# Altium schematic sheet TITLE.SchDoc: F2837x controlCARD
size 431 x 279 mm; Organization: Texas Instruments; Revision: 1.3
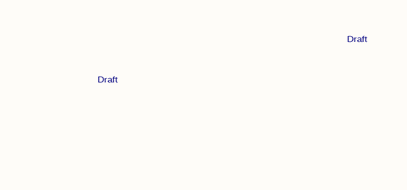
[diagram p0: TITLE.SchDoc, top right]
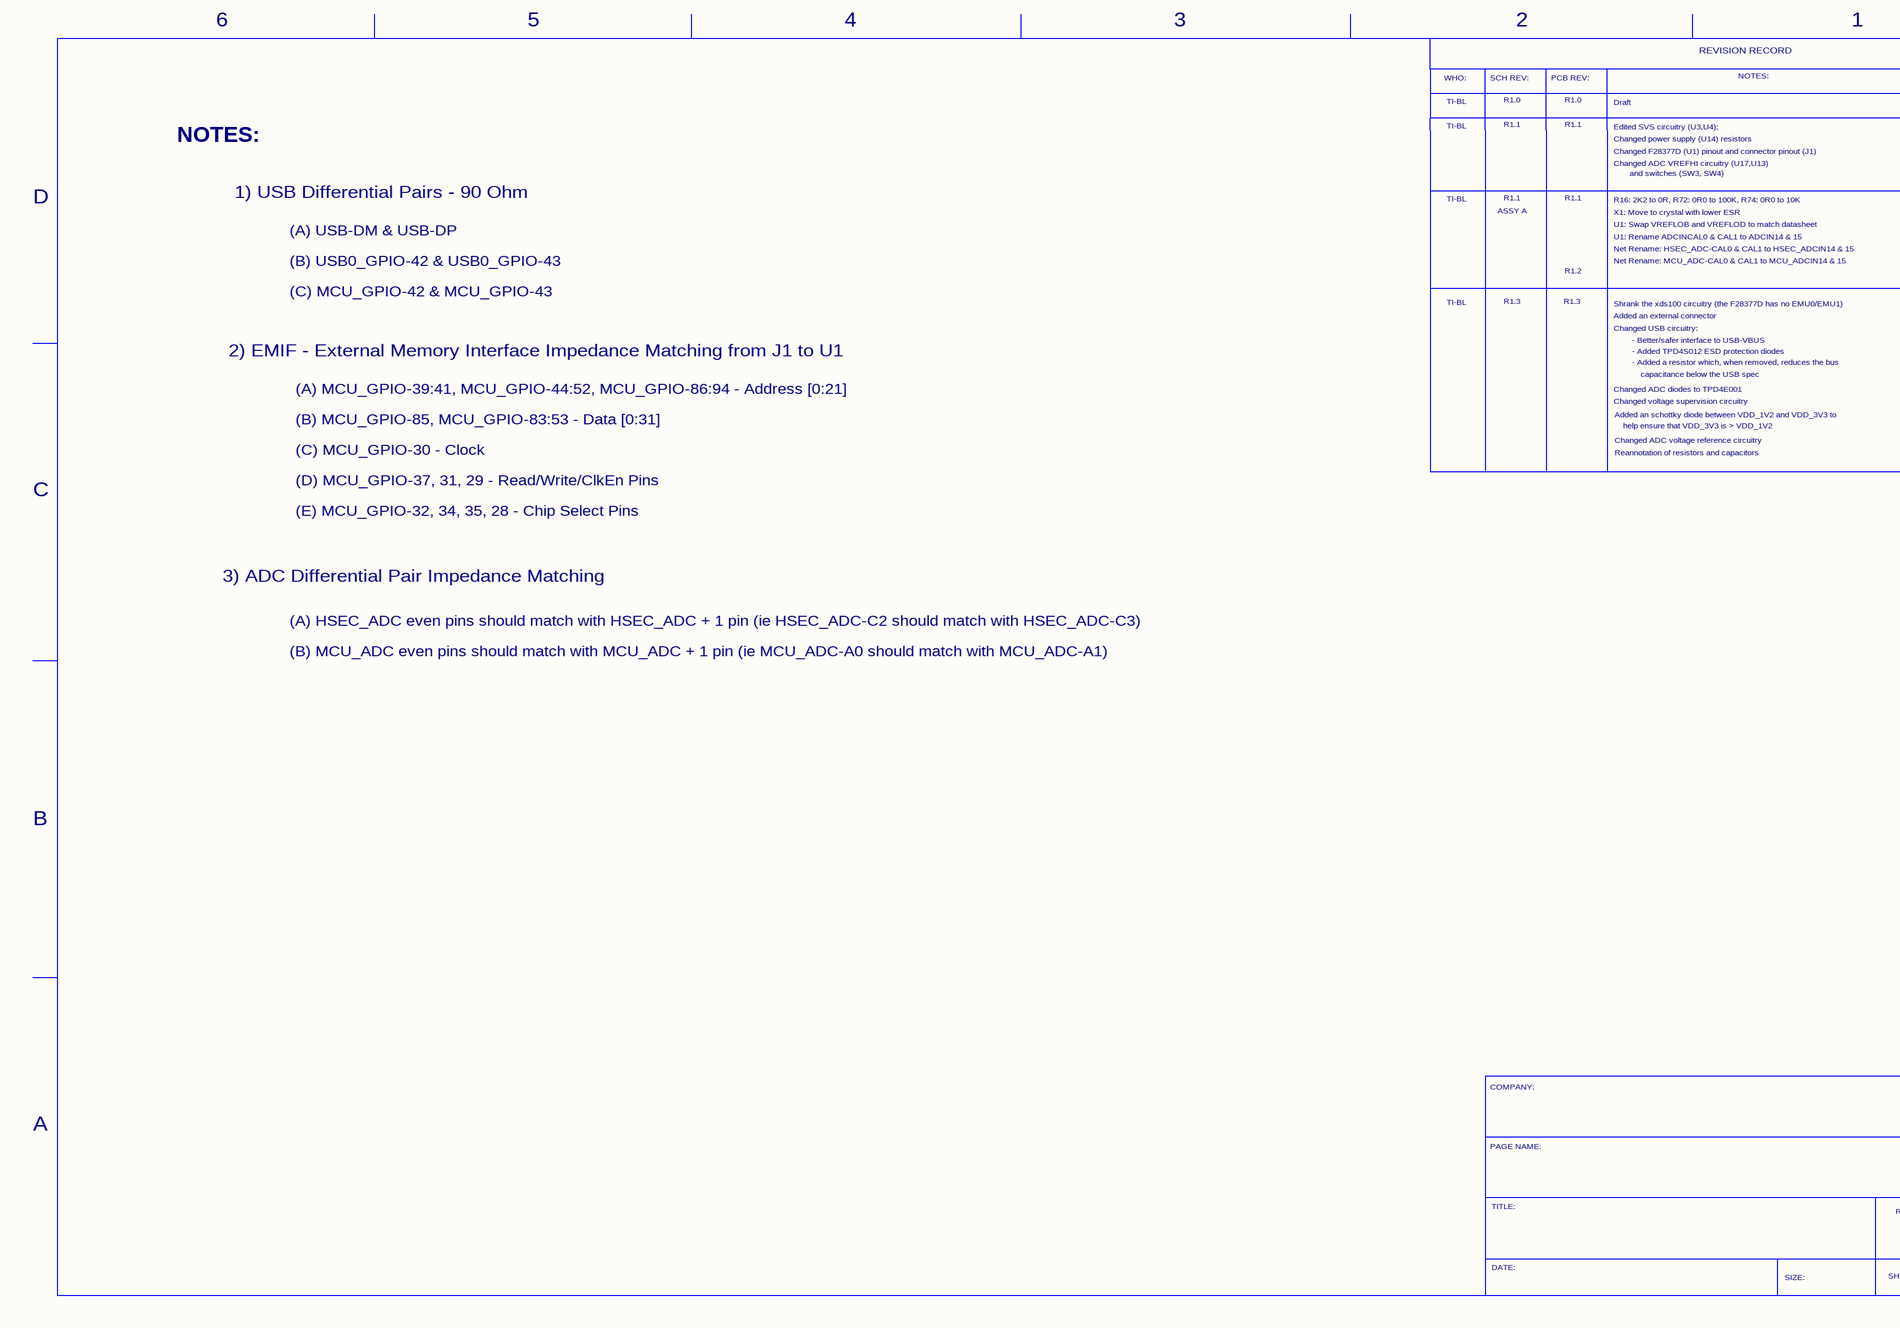
[diagram p1: TITLE.SchDoc, bottom left]
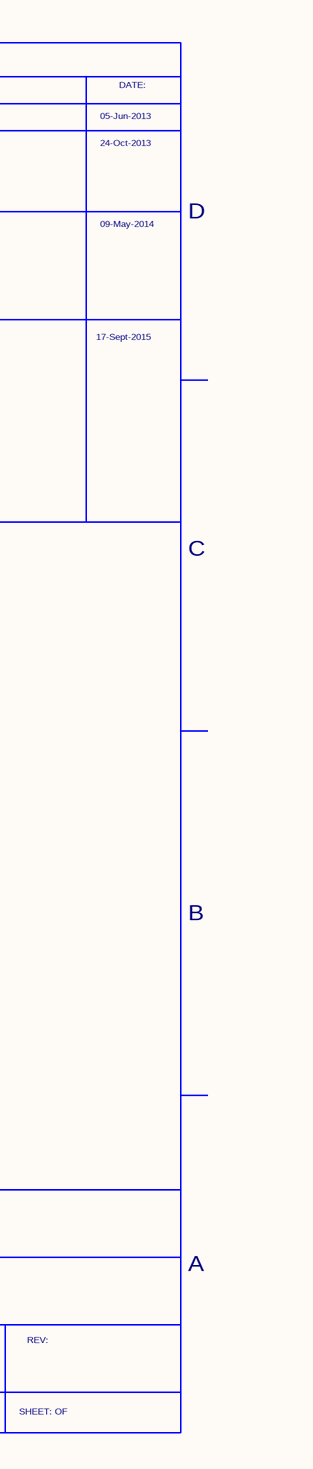
[diagram p2: TITLE.SchDoc, bottom right]

## Notes on the sheet
- Draft
- 6
- 5
- 4
- 3
- 2
- REVISION RECORD
- 1
- WHO:
- TI-BL
- SCH REV:
- R1.1
- R1.0
- PCB REV:
- Edited SVS circuitry (U3,U4);
- NOTES:
- 24-Oct-2013
- 05-Jun-2013
- DATE:
- Changed power supply (U14) resistors
- Changed F28377D (U1) pinout and connector pinout (J1)
- Changed ADC VREFHI circuitry (U17,U13)
- and switches (SW3, SW4)
- D
- 1) USB Differential Pairs - 90 Ohm
- (A) USB-DM & USB-DP
- ASSY A
- R16: 2K2 to 0R, R72: 0R0 to 100K, R74: 0R0 to 10K
- Net Rename: HSEC_ADC-CAL0 & CAL1 to HSEC_ADCIN14 & 15
- U1: Swap VREFLOB and VREFLOD to match datasheet
- U1: Rename ADCINCAL0 & CAL1 to ADCIN14 & 15
- X1: Move to crystal with lower ESR
- 09-May-2014
- (B) USB0_GPIO-42 & USB0_GPIO-43
- (C) MCU_GPIO-42 & MCU_GPIO-43
- R1.3
- R1.2
- Net Rename: MCU_ADC-CAL0 & CAL1 to MCU_ADCIN14 & 15
- Shrank the xds100 circuitry (the F28377D has no EMU0/EMU1)
- Added an external connector
- 17-Sept-2015
- 2) EMIF - External Memory Interface Impedance Matching from J1 to U1
- Changed USB circuitry:
- - Better/safer interface to USB-VBUS
- - Added TPD4S012 ESD protection diodes
- - Added a resistor which, when removed, reduces the bus
- capacitance below the USB spec
- (A) MCU_GPIO-39:41, MCU_GPIO-44:52, MCU_GPIO-86:94 - Address [0:21]
- (B) MCU_GPIO-85, MCU_GPIO-83:53 - Data [0:31]
- Changed voltage supervision circuitry
- Changed ADC diodes to TPD4E001
- Added an schottky diode between VDD_1V2 and VDD_3V3 to
- Changed ADC voltage reference circuitry
- help ensure that VDD_3V3 is > VDD_1V2
- C
- (C) MCU_GPIO-30 - Clock
- (D) MCU_GPIO-37, 31, 29 - Read/Write/ClkEn Pins
- Reannotation of resistors and capacitors
- (E) MCU_GPIO-32, 34, 35, 28 - Chip Select Pins
- 3) ADC Differential Pair Impedance Matching
- (A) HSEC_ADC even pins should match with HSEC_ADC + 1 pin (ie HSEC_ADC-C2 should match with HSEC_ADC-C3)
- (B) MCU_ADC even pins should match with MCU_ADC + 1 pin (ie MCU_ADC-A0 should match with MCU_ADC-A1)
- B
- COMPANY:
- A
- PAGE NAME:
- TITLE:
- REV:
- SIZE:
- SHEET: OF